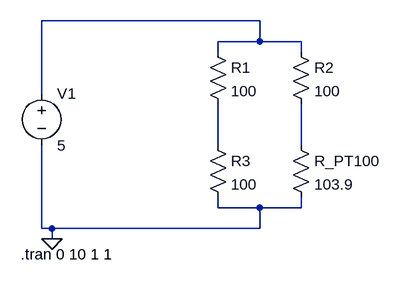
[diagram p0: schematic wheatstone_bridge.asc]
wheatstone_bridge.asc, the LTspice schematic file:
Version 4
SHEET 1 880 680
WIRE 208 32 -128 32
WIRE 208 64 208 32
WIRE 208 64 144 64
WIRE 272 64 208 64
WIRE 144 80 144 64
WIRE 272 80 272 64
WIRE -128 144 -128 32
WIRE 144 224 144 160
WIRE 272 224 272 160
WIRE 144 320 144 304
WIRE 208 320 144 320
WIRE 272 320 272 304
WIRE 272 320 208 320
WIRE -128 352 -128 224
WIRE -112 352 -128 352
WIRE 208 352 208 320
WIRE 208 352 -112 352
WIRE -112 368 -112 352
FLAG -112 368 0
SYMBOL res 128 64 R0
SYMATTR InstName R1
SYMATTR Value 100
SYMBOL res 128 208 R0
SYMATTR InstName R3
SYMATTR Value 100
SYMBOL res 256 64 R0
SYMATTR InstName R2
SYMATTR Value 100
SYMBOL res 256 208 R0
SYMATTR InstName R_PT100
SYMATTR Value 103.9
SYMBOL voltage -128 128 R0
SYMATTR InstName V1
SYMATTR Value 5
TEXT -160 392 Left 2 !.tran 0 10 1 1

The netlist it stands for:
* wheatstone_bridge.asc
R1 N001 N002 100
R3 N002 0 100
R2 N001 N003 100
R_PT100 N003 0 103.9
V1 N001 0 5
.tran 0 10 1 1
.backanno
.end